# Altium schematic sheet 核心板原理图.SchDoc
size A2
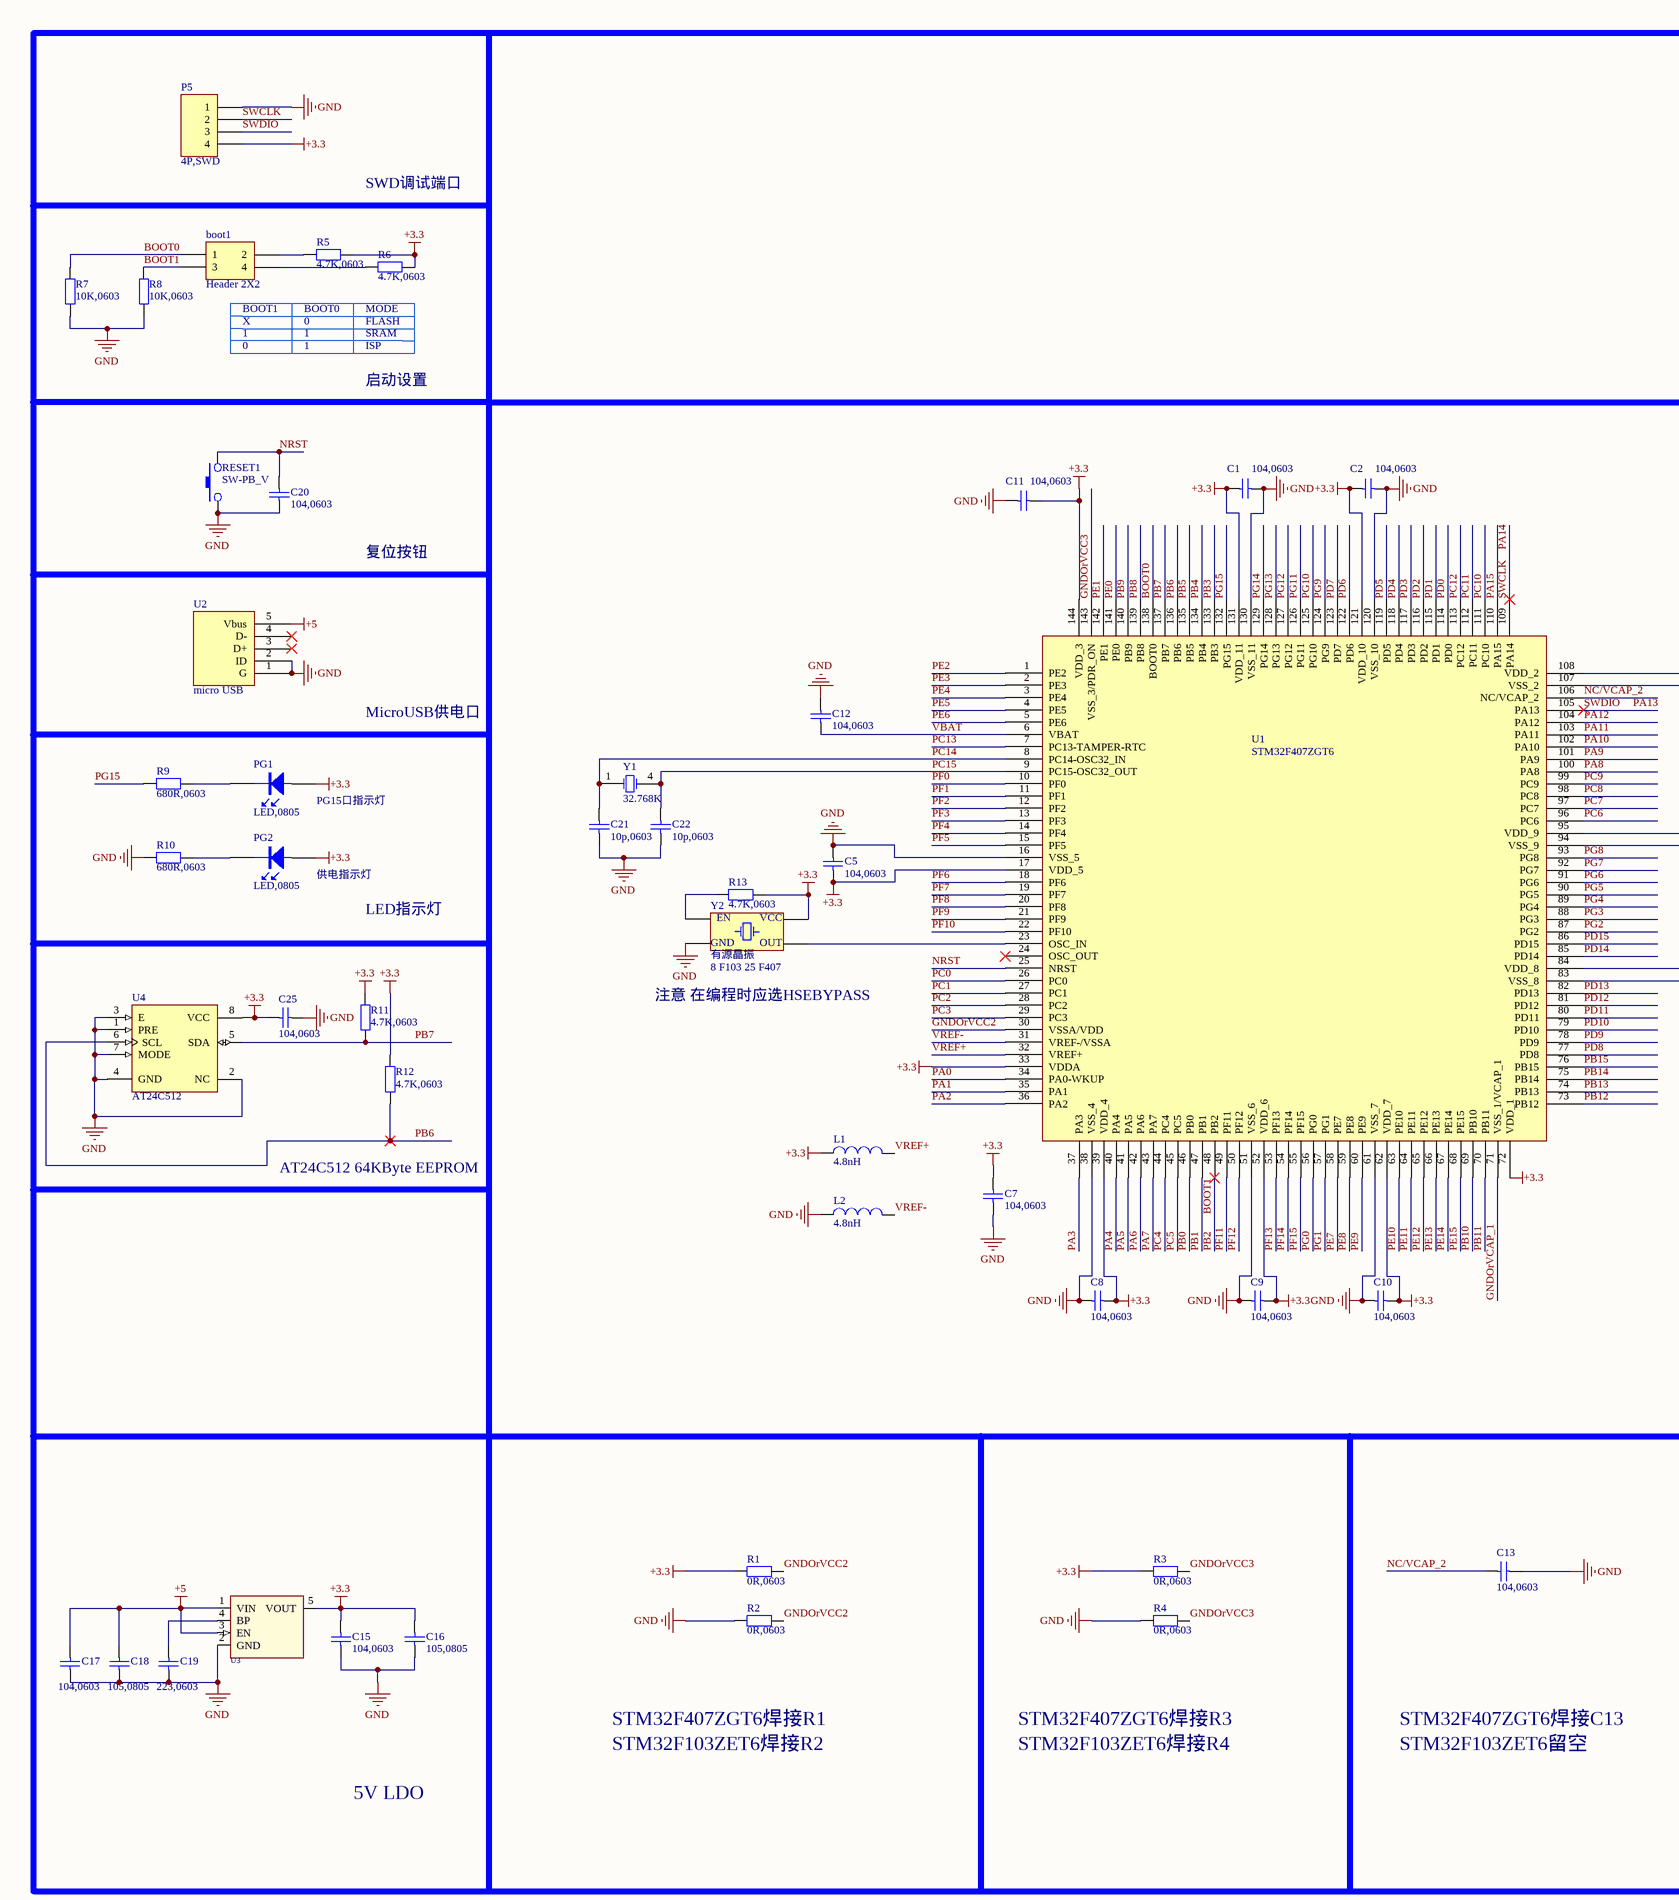
[diagram p0: 核心板原理图.SchDoc, left]
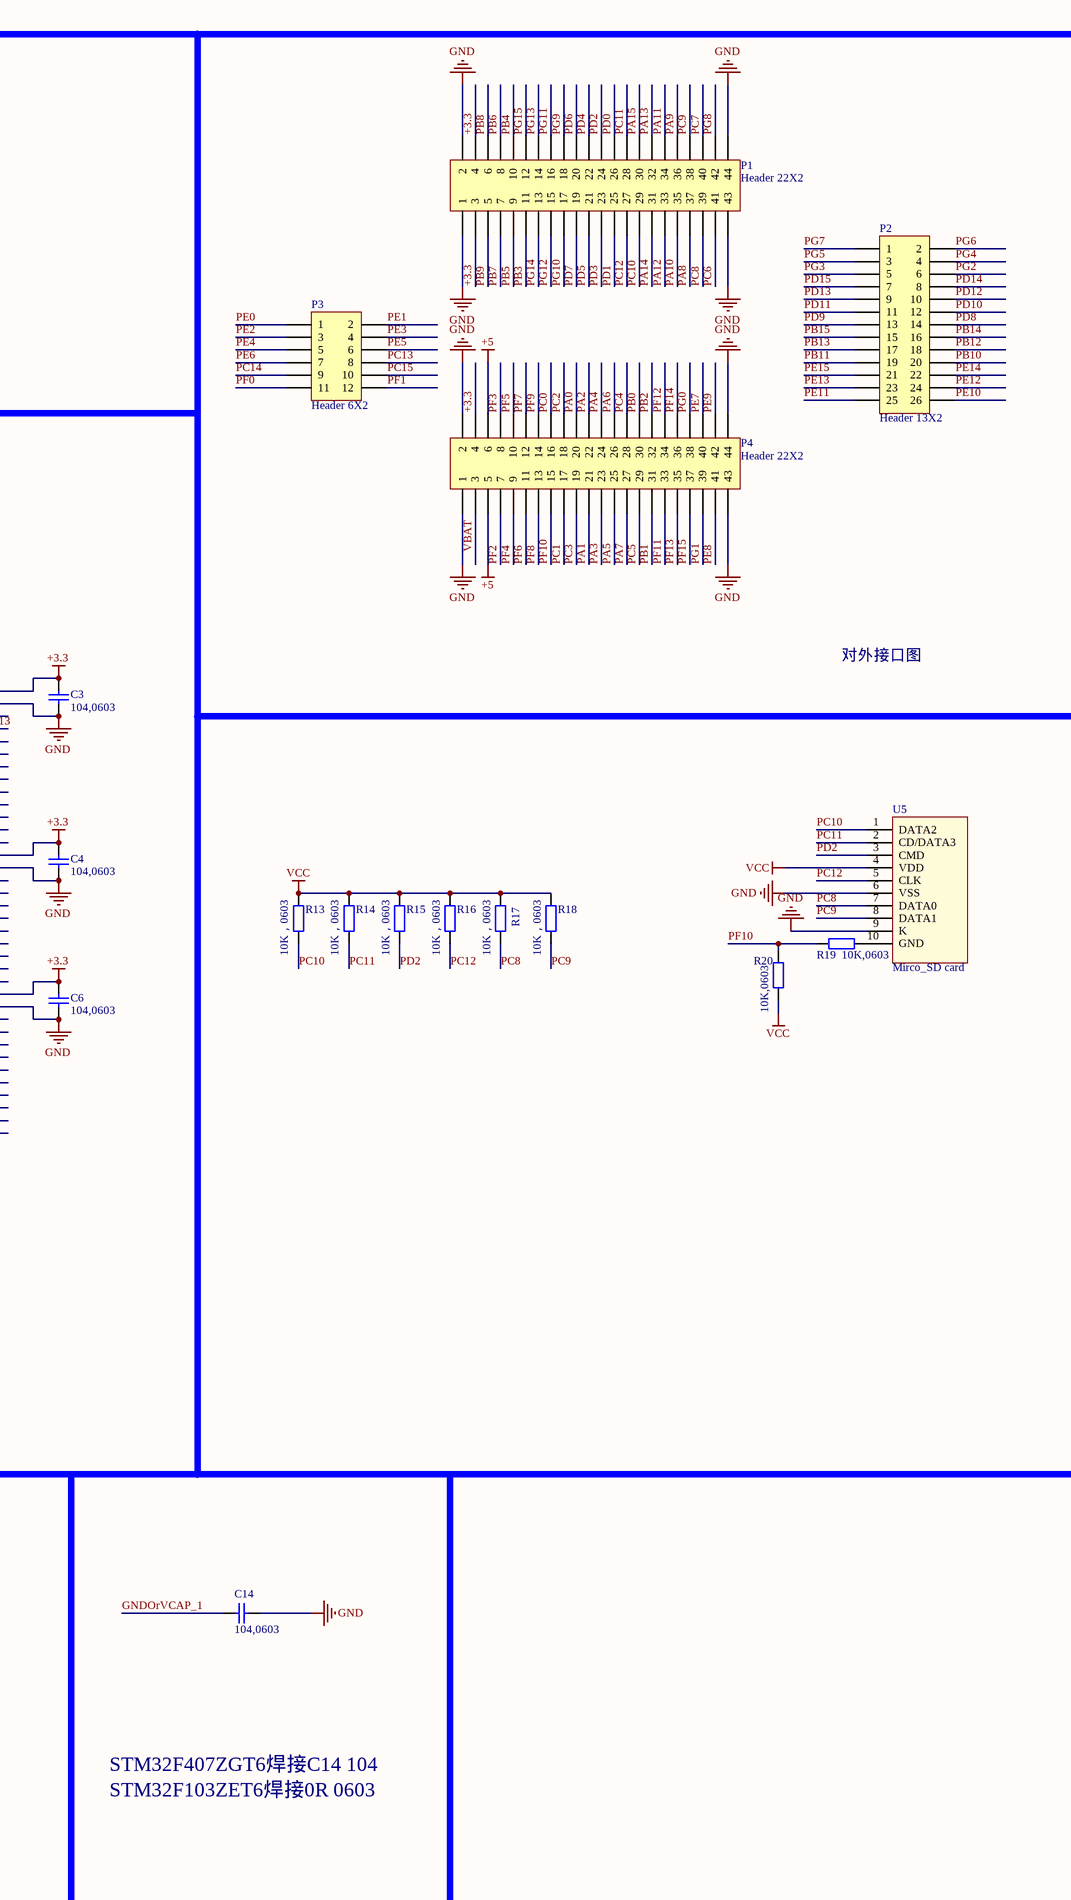
[diagram p1: 核心板原理图.SchDoc, right]

## Parts
(Parts that share a designator on the sheet are numbered #1, #2 ... from top to bottom, then left to right.)
boot1  Header 2X2  [BOOT]
C1  104,0603  [C0603]
C2  104,0603  [C0603]
C3  104,0603  [C0603]
C4  104,0603  [C0603]
C5  104,0603  [C0603]
C6  104,0603  [C0603]
C7  104,0603  [C0603]
C8  104,0603  [C0603]
C9  104,0603  [C0603]
C10  104,0603  [C0603]
C11  104,0603  [C0603]
C12  104,0603  [C0603]
C13  104,0603  [C0603]
C14  104,0603  [C0603]
C15  104,0603  [C0603]
C16  105,0805  [C0805tan]
C17  104,0603  [C0603]
C18  105,0805  [C0805tan]
C19  223,0603  [C0603]
C20  104,0603  [C0603]
C21  10p,0603  [C0603]
C22  10p,0603  [C0603]
C25  104,0603  [C0603]
L1  4.8nH  [L0603]
L2  4.8nH  [L0603]
P1  Header 22X2  [HDR2X22]
P2  Header 13X2  [HDR2X13]
P3  Header 6X2  [HDR2X6]
P4  Header 22X2  [HDR2X22 - duplicate]
P5  4P,SWD  [HDR1X4]
PG1  LED,0805  [LED0603]
PG2  LED,0805  [LED0603]
R1  0R,0603  [R0603]
R2  0R,0603  [R0603]
R3  0R,0603  [R0603]
R4  0R,0603  [R0603]
R5  4.7K,0603  [R0603]
R6  4.7K,0603  [R0603]
R7  10K,0603  [R0603]
R8  10K,0603  [R0603]
R9  680R,0603  [R0603]
R10  680R,0603  [R0603]
R11  4.7K,0603  [R0603]
R12  4.7K,0603  [R0603]
R13#1  4.7K,0603  [R0603]
R13#2  10K，0603  [R 0603_M]
R14  10K，0603  [R 0603_M]
R15  10K，0603  [R 0603_M]
R16  10K，0603  [R 0603_M]
R17  10K，0603  [R 0603_M]
R18  10K，0603  [R 0603_M]
R19  10K,0603  [R 0603_M]
R20  10K,0603  [R 0603_M]
RESET1  SW-PB_V  [KEY-SMT]
U1  STM32F407ZGT6  [TQFP-144]
U2  micro USB  [Micro_USB_v2 - duplicate]
U3  RT9193  [SOT-23-5]  (value not drawn)
U4  AT24C512  [SOP8_N]
U5  Mirco_SD card  [Micro SD]
Y1  32.768K  [MC-306]
Y2  有源晶振  [OSC 3225-4P]

## Nets
+3.3: C1.1 C2.1 C3.1 C4.1 C5.1 C6.1 C7.1 C8.1 C9.1 C10.1 C11.2 C15.2 C16.2 C25.1 L1.1 P1.3 P1.4 P4.4 P5.4 PG1.1 PG2.1 R1.1 R3.1 R5.2 R6.2 R11.2 R12.2 R13#1.2 U1.17(VDD_5) U1.33(VDDA) U1.39(VDD_4) U1.52(VDD_6) U1.62(VDD_7) U1.72(VDD_1) U1.84(VDD_8) U1.95(VDD_9) U1.108(VDD_2) U1.121(VDD_10) U1.131(VDD_11) U1.144(VDD_3) U3.5(VOUT) U4.8(VCC) Y2.4(VCC)
+5: C17.2 C18.2 P4.5 P4.6 U2.5(Vbus) U3.1(VIN) U3.3(EN)
GND: C1.2 C2.2 C3.2 C4.2 C5.2 C6.2 C7.2 C8.2 C9.2 C10.2 C11.1 C12.2 C13.1 C14.1 C15.1 C16.1 C17.1 C18.1 C19.1 C20.2 C21.1 C22.1 C25.2 L2.1 P1.1 P1.2 P1.43 P1.44 P4.1 P4.2 P4.43 P4.44 P5.1 R2.1 R4.1 R7.1 R8.1 R10.1 RESET1.1 U1.16(VSS_5) U1.38(VSS_4) U1.51(VSS_6) U1.61(VSS_7) U1.83(VSS_8) U1.94(VSS_9) U1.107(VSS_2) U1.120(VSS_10) U1.130(VSS_11) U2.1(G) U2.2(ID) U3.2(GND) U4.1(PRE) U4.2(NC) U4.3(E) U4.4(GND) U4.7(MODE) U5.6(VSS) U5.9(K) Y2.2(GND)
VCC: R13#2.2 R14.2 R15.2 R16.2 R17.2 R18.2 R20.1 U5.4(VDD)
BOOT0: boot1.1 R7.2 U1.138(BOOT0)
BOOT1: boot1.3 P4.32 R8.2 U1.48(PB2)  [also labelled PB2]
GNDOrVCAP_1: C14.2 U1.71(VSS_1/VCAP_1)
GNDOrVCC2: R1.2 R2.2 U1.30(VSSA/VDD)
GNDOrVCC3: R3.2 R4.2 U1.143(VSS_3/PDR_ON)
NC/VCAP_2: C13.2 U1.106(NC/VCAP_2)
NRST: C20.1 RESET1.2 U1.25(NRST)
PA0: P4.20 U1.34(PA0-WKUP)
PA1: P4.21 U1.35(PA1)
PA2: P4.22 U1.36(PA2)
PA3: P4.23 U1.37(PA3)
PA4: P4.24 U1.40(PA4)
PA5: P4.25 U1.41(PA5)
PA6: P4.26 U1.42(PA6)
PA7: P4.27 U1.43(PA7)
PA8: P1.37 U1.100(PA8)
PA9: P1.36 U1.101(PA9)
PA10: P1.35 U1.102(PA10)
PA11: P1.34 U1.103(PA11)
PA12: P1.33 U1.104(PA12)
PA13: P1.32 P5.3 U1.105(PA13)  [also labelled SWDIO]
PA14: P1.31 P5.2 U1.109(PA14)  [also labelled SWCLK]
PA15: P1.30 U1.110(PA15)
PB0: P4.30 U1.46(PB0)
PB1: P4.31 U1.47(PB1)
PB3: P1.11 U1.133(PB3)
PB4: P1.10 U1.134(PB4)
PB5: P1.9 U1.135(PB5)
PB6: P1.8 R12.1 U1.136(PB6) U4.6(SCL)
PB7: P1.7 R11.1 U1.137(PB7) U4.5(SDA)
PB8: P1.6 U1.139(PB8)
PB9: P1.5 U1.140(PB9)
PB10: P2.20 U1.69(PB10)
PB11: P2.19 U1.70(PB11)
PB12: P2.18 U1.73(PB12)
PB13: P2.17 U1.74(PB13)
PB14: P2.16 U1.75(PB14)
PB15: P2.15 U1.76(PB15)
PC0: P4.16 U1.26(PC0)
PC1: P4.17 U1.27(PC1)
PC2: P4.18 U1.28(PC2)
PC3: P4.19 U1.29(PC3)
PC4: P4.28 U1.44(PC4)
PC5: P4.29 U1.45(PC5)
PC6: P1.41 U1.96(PC6)
PC7: P1.40 U1.97(PC7)
PC8: P1.39 R17.1 U1.98(PC8) U5.7(DATA0)
PC9: P1.38 R18.1 U1.99(PC9) U5.8(DATA1)
PC10: P1.29 R13#2.1 U1.111(PC10) U5.1(DATA2)
PC11: P1.28 R14.1 U1.112(PC11) U5.2(CD/DATA3)
PC12: P1.27 R16.1 U1.113(PC12) U5.5(CLK)
PC13: P3.8 U1.7(PC13-TAMPER-RTC)
PC14: C21.2 P3.9 U1.8(PC14-OSC32_IN) Y1.1(OSC1)
PC15: C22.2 P3.10 U1.9(PC15-OSC32_OUT) Y1.4(OSC2)
PD0: P1.26 U1.114(PD0)
PD1: P1.25 U1.115(PD1)
PD2: P1.24 R15.1 U1.116(PD2) U5.3(CMD)
PD3: P1.23 U1.117(PD3)
PD4: P1.22 U1.118(PD4)
PD5: P1.21 U1.119(PD5)
PD6: P1.20 U1.122(PD6)
PD7: P1.19 U1.123(PD7)
PD8: P2.14 U1.77(PD8)
PD9: P2.13 U1.78(PD9)
PD10: P2.12 U1.79(PD10)
PD11: P2.11 U1.80(PD11)
PD12: P2.10 U1.81(PD12)
PD13: P2.9 U1.82(PD13)
PD14: P2.8 U1.85(PD14)
PD15: P2.7 U1.86(PD15)
PE0: P3.1 U1.141(PE0)
PE1: P3.2 U1.142(PE1)
PE2: P3.3 U1.1(PE2)
PE3: P3.4 U1.2(PE3)
PE4: P3.5 U1.3(PE4)
PE5: P3.6 U1.4(PE5)
PE6: P3.7 U1.5(PE6)
PE7: P4.40 U1.58(PE7)
PE8: P4.41 U1.59(PE8)
PE9: P4.42 U1.60(PE9)
PE10: P2.26 U1.63(PE10)
PE11: P2.25 U1.64(PE11)
PE12: P2.24 U1.65(PE12)
PE13: P2.23 U1.66(PE13)
PE14: P2.22 U1.67(PE14)
PE15: P2.21 U1.68(PE15)
PF0: P3.11 U1.10(PF0)
PF1: P3.12 U1.11(PF1)
PF2: P4.7 U1.12(PF2)
PF3: P4.8 U1.13(PF3)
PF4: P4.9 U1.14(PF4)
PF5: P4.10 U1.15(PF5)
PF6: P4.11 U1.18(PF6)
PF7: P4.12 U1.19(PF7)
PF8: P4.13 U1.20(PF8)
PF9: P4.14 U1.21(PF9)
PF10: P4.15 R19.1 R20.2 U1.22(PF10)
PF11: P4.33 U1.49(PF11)
PF12: P4.34 U1.50(PF12)
PF13: P4.35 U1.53(PF13)
PF14: P4.36 U1.54(PF14)
PF15: P4.37 U1.55(PF15)
PG0: P4.38 U1.56(PG0)
PG1: P4.39 U1.57(PG1)
PG2: P2.6 U1.87(PG2)
PG3: P2.5 U1.88(PG3)
PG4: P2.4 U1.89(PG4)
PG5: P2.3 U1.90(PG5)
PG6: P2.2 U1.91(PG6)
PG7: P2.1 U1.92(PG7)
PG8: P1.42 U1.93(PG8)
PG9: P1.18 U1.124(PG9)
PG10: P1.17 U1.125(PG10)
PG11: P1.16 U1.126(PG11)
PG12: P1.15 U1.127(PG12)
PG13: P1.14 U1.128(PG13)
PG14: P1.13 U1.129(PG14)
PG15: P1.12 R9.1 U1.132(PG15)
VBAT: C12.1 P4.3 U1.6(VBAT)
VREF+: L1.2 U1.32(VREF+)
VREF-: L2.2 U1.31(VREF-/VSSA)
Netboot1_2: boot1.2 R5.1
Netboot1_4: boot1.4 R6.1
NetC19_2: C19.2 U3.4(BP)
NetPG1_2: PG1.2 R9.2
NetPG2_2: PG2.2 R10.2
NetR13#1_1: R13#1.1 Y2.1(EN)
NetR19_2: R19.2 U5.10(GND)
NetU1_23: U1.23(OSC_IN) Y2.3(OUT)

Not connected (* = marked no-connect by the designer): U1 24(OSC_OUT)*; U2 3(D+)* 4(D-)*

## Notes on the sheet
- SWD调试端口
- (near boot1) BOOT1
- X
- 1
- 0
- BOOT0
- MODE
- FLASH
- SRAM
- ISP
- 启动设置
- 复位按钮
- 对外接口图
- MicroUSB供电口
- (near PG1) PG15口指示灯
- (near PG2) 供电指示灯
- LED指示灯
- (near Y2) 8 F103 25 F407
- (near Y2) 注意 在编程时应选HSEBYPASS
- AT24C512 64KByte EEPROM
- STM32F407ZGT6焊接R1
- STM32F103ZET6焊接R2
- STM32F407ZGT6焊接R3
- STM32F103ZET6焊接R4
- STM32F407ZGT6焊接C13
- STM32F103ZET6留空
- STM32F407ZGT6焊接C14 104
- STM32F103ZET6焊接0R 0603
- 5V LDO

## Library data of the parts
boot1 = Header 2X2: Header, 2-Pin, Dual row; LatestRevisionDate: 17-Jul-2002; LatestRevisionNote: Re-released for DXP Platform.; Publisher: Altium Limited
C1-C22 C25 = CAP: Capacitor; Value: 100nF; Published: 8-Jun-2000; Revision: July-2002: Re-released for DXP Platform.; Publisher: Altium Limited
L1 L2 = Inductor: Code_IEC: 1005; Published: 8-Jun-2000; LatestRevisionDate: 17-Jul-2002; LatestRevisionNote: Re-released for DXP Platform.; PackageReference: 0402-A; Publisher: Altium Limited; Code_JEITA: 0402
P1 P4 = Header 22X2: Header, 22-Pin, Dual row; LatestRevisionDate: 17-Jul-2002; LatestRevisionNote: Re-released for DXP Platform.; Publisher: Altium Limited
P2 = Header 13X2: Header, 13-Pin, Dual row; LatestRevisionDate: 17-Jul-2002; LatestRevisionNote: Re-released for DXP Platform.; Publisher: Altium Limited
P3 = Header 6X2: Header, 6-Pin, Dual row; LatestRevisionDate: 17-Jul-2002; LatestRevisionNote: Re-released for DXP Platform.; Publisher: Altium Limited
P5 = Header 4: Header, 4-Pin; LatestRevisionDate: 17-Jul-2002; LatestRevisionNote: Re-released for DXP Platform.; Publisher: Altium Limited
PG1 PG2 = LED
R1-R12 R13#1 = Res2: Resistor; Published: 8-Jun-2000; LatestRevisionDate: 17-Jul-2002; LatestRevisionNote: Re-released for DXP Platform.; PackageReference: AXIAL-0.4; Publisher: Altium Limited
R13#2 R14-R20 = R: 贴片电阻; 版权归属: 源创客; BOM名称: 贴片电阻; 学习资源: www.ooocke.com
RESET1 = SW-PB_V: SWITCH
U1 = STM32F103ZET6: STM32F103ZE
U2 = usb-STM
U3 = RT9193X_5P: ICA_MFR_NAME: RICHTEK; ICA_PARTNUM: $$2191094$$RT9193-15CU5; Part Number: TMP-13
U4 = ST24C08RB5: Serial 8K (1K x 8) EEPROM; Published: 24-Aug-2001; LatestRevisionDate: 06-Jun-2005; LatestRevisionNote: Stylized 3D Model Added.; DatasheetVersion: Jul-1996; PackageVersion: Jun-1998; PackageReference: PSDIP8A; Publisher: Altium Limited; PackageDescription: DIP; 8 Leads; Row Spacing 7.62 mm; Pitch 2.54 mm; ComponentLink1Description: Manufacturer Link; ComponentLink1URL: http://www.st.com/
U5 = TF_Card: TF卡座; 版权归属: 源创客; BOM名称: TF卡座; 学习资源: www.ooocke.com
Y1 = XTAL: Crystal Oscillator; Published: 8-Jun-2000; LatestRevisionDate: 17-Jul-2002; LatestRevisionNote: Re-released for DXP Platform.; Publisher: Altium Limited
Y2 = XTAL_Active